# Altium schematic sheet FUSE_AND_I_SENSE.SchDoc
size A; SheetNumber: 13; SheetTotal: 19
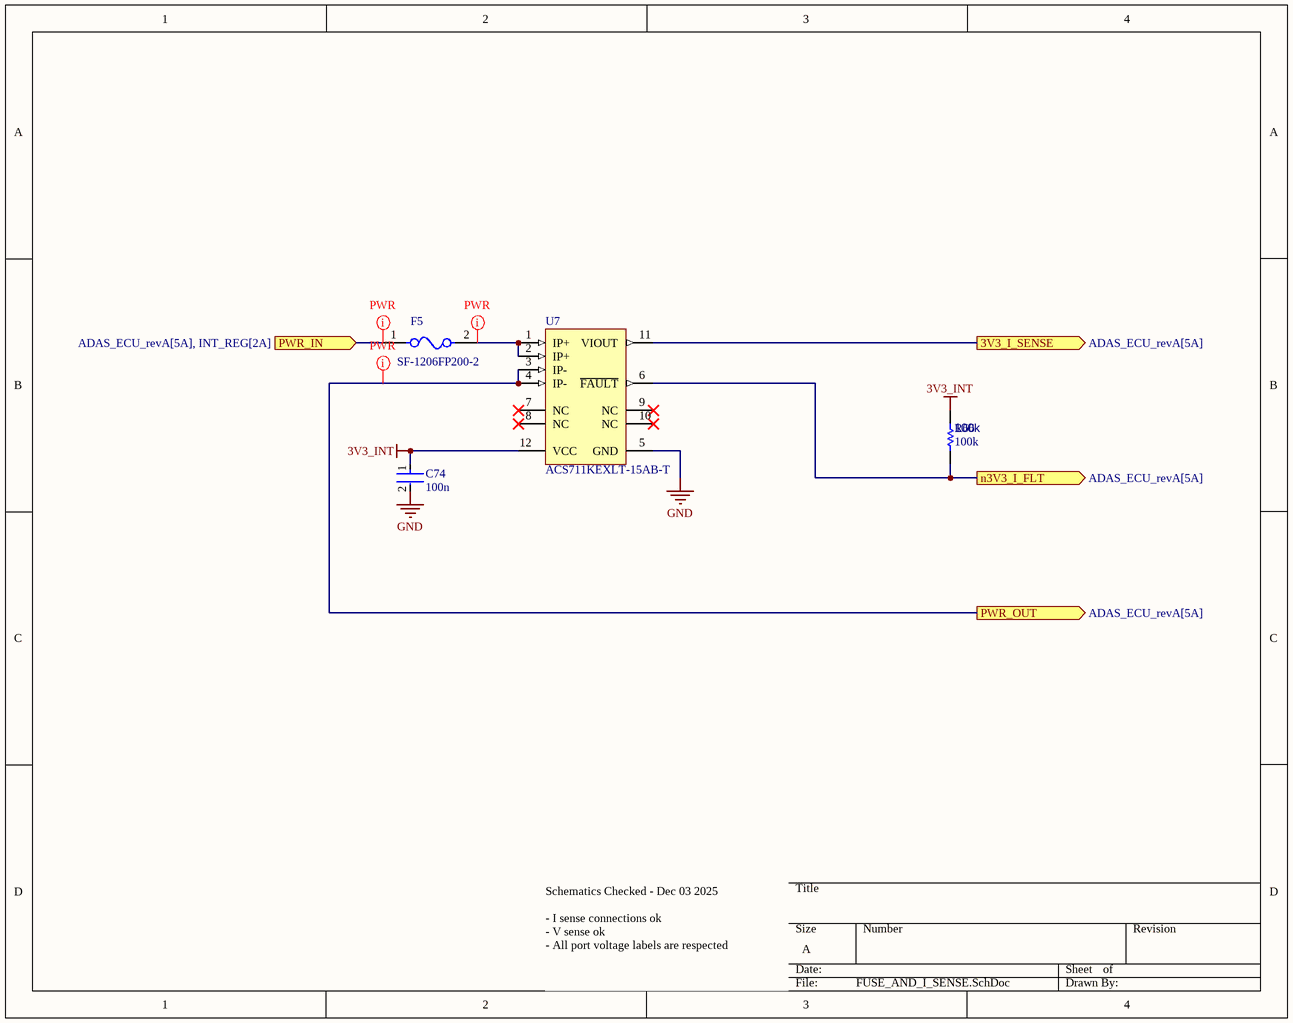
[diagram p0: FUSE_AND_I_SENSE.SchDoc]

## Parts
C74  100n  [FP-0402-L_1_0_0_05-W_0_5-IPC_A]
F5  SF-1206FP200-2  [FP-SF-1206FP-MFG]
R66  100k  [R0603B]
U7  ACS711KEXLT-15AB-T  [ALEG-EX-12_V]

## Ports
3V3_I_SENSE (out, see ADAS_ECU_revA[5A]), n3V3_I_FLT (out, see ADAS_ECU_revA[5A]), PWR_IN (in, see ADAS_ECU_revA[5A], INT_REG[2A]), PWR_OUT (out, see ADAS_ECU_revA[5A])

## Nets
3V3_INT: C74.1 R66.2 U7.12(VCC)
GND: C74.2 U7.5(GND)
3V3_I_SENSE: U7.11(VIOUT) ; port 3V3_I_SENSE
n3V3_I_FLT: R66.1 U7.6(~{FAULT}) ; port n3V3_I_FLT
PWR_IN: F5.1 ; port PWR_IN
PWR_OUT: U7.3(IP-) U7.4(IP-) ; port PWR_OUT
NetF5_2: F5.2 U7.1(IP+) U7.2(IP+)

Not connected (* = marked no-connect by the designer): U7 7(NC)* 8(NC)* 9(NC)* 10(NC)*

## Layout directives
net class PWR: NetF5_2, PWR_IN, PWR_OUT

## Notes on the sheet
- Schematics Checked - Dec 03 2025
  - I sense connections ok
  - V sense ok
  - All port voltage labels are respected

## Library data of the parts
C74 = CMP-001-00058-1: LARGE PADS, 0402 CAP, CHANGE COMMENT TO MATCH REAL P/N; Capacitor Type: Ceramic; Min Operating Temperature: -55°C; Mounting Technology: Surface Mount; Pins: 2; Case/Package: 0402; RoHS Compliant: Yes; Max Operating Temperature: 85°C
F5 = CMP-07399-000013-1: FUSE BOARD MOUNT 2A 63VDC 1206; Voltage Rating (DC): 63V; Fuse Type: Board Mount (Cartridge Style Excluded); Approvals: UL; Mount: Surface Mount; Min Operating Temperature: -20°C; Max Operating Temperature: 105°C; Case Code (Imperial): 1206; Packaging: Cut Tape; Current Rating: 2A; RoHS Compliant: Yes; Series: SinglFuse™ SF-1206FP; Case Code (Metric): 3216; Case/Package: 1206
R66 = CMP-009-00002-14: Resistor; Value: 100k
U7 = CMP-1557-00001-1: Hall Effect Linear Current Sensor with Overcurrent Fault Output for <100 V Isolation Applications, 3 to 5.5 V, -15.5 to 15.5 A IP, -40 to 125 degC, 12-Pin QFN (EX), RoHS, Tape and Reel; VCC Max: 5.5 V; IP Max: 15.5 A; VCC Min: 3 V; IP Min: -15.5 A; -3dB Bandwidth: 0.1 MHz; PackageDescription: 12-Pin Quad Flat No-Lead, Body 3 x 3 mm, Height 0.8 mm; ComponentLink1URL: http://www.allegromicro.com/; Packing: Tape and Reel; ComponentLink2URL: http://www.allegromicro.com/~/media/Files/Datasheets/ACS711-Datasheet.ashx?la=en; DatasheetVersion: Rev. 3; PartNumber: ACS711KEXLT-15AB-T; ComponentLink2Description: Datasheet; ComponentLink3URL: http://www.allegromicro.com/~/media/Files/Datasheets/ACS711-Datasheet.ashx?la=en; RoHS: TRUE; ComponentLink1Description: Manufacturer URL; ComponentLink3Description: Package Specification; Temperature Max: 125 degC; Mounting Technology: Surface Mount; Temperature Min: -40 degC